# EAGLE design webUSB_V2 combined (EAGLE 9.6.2)
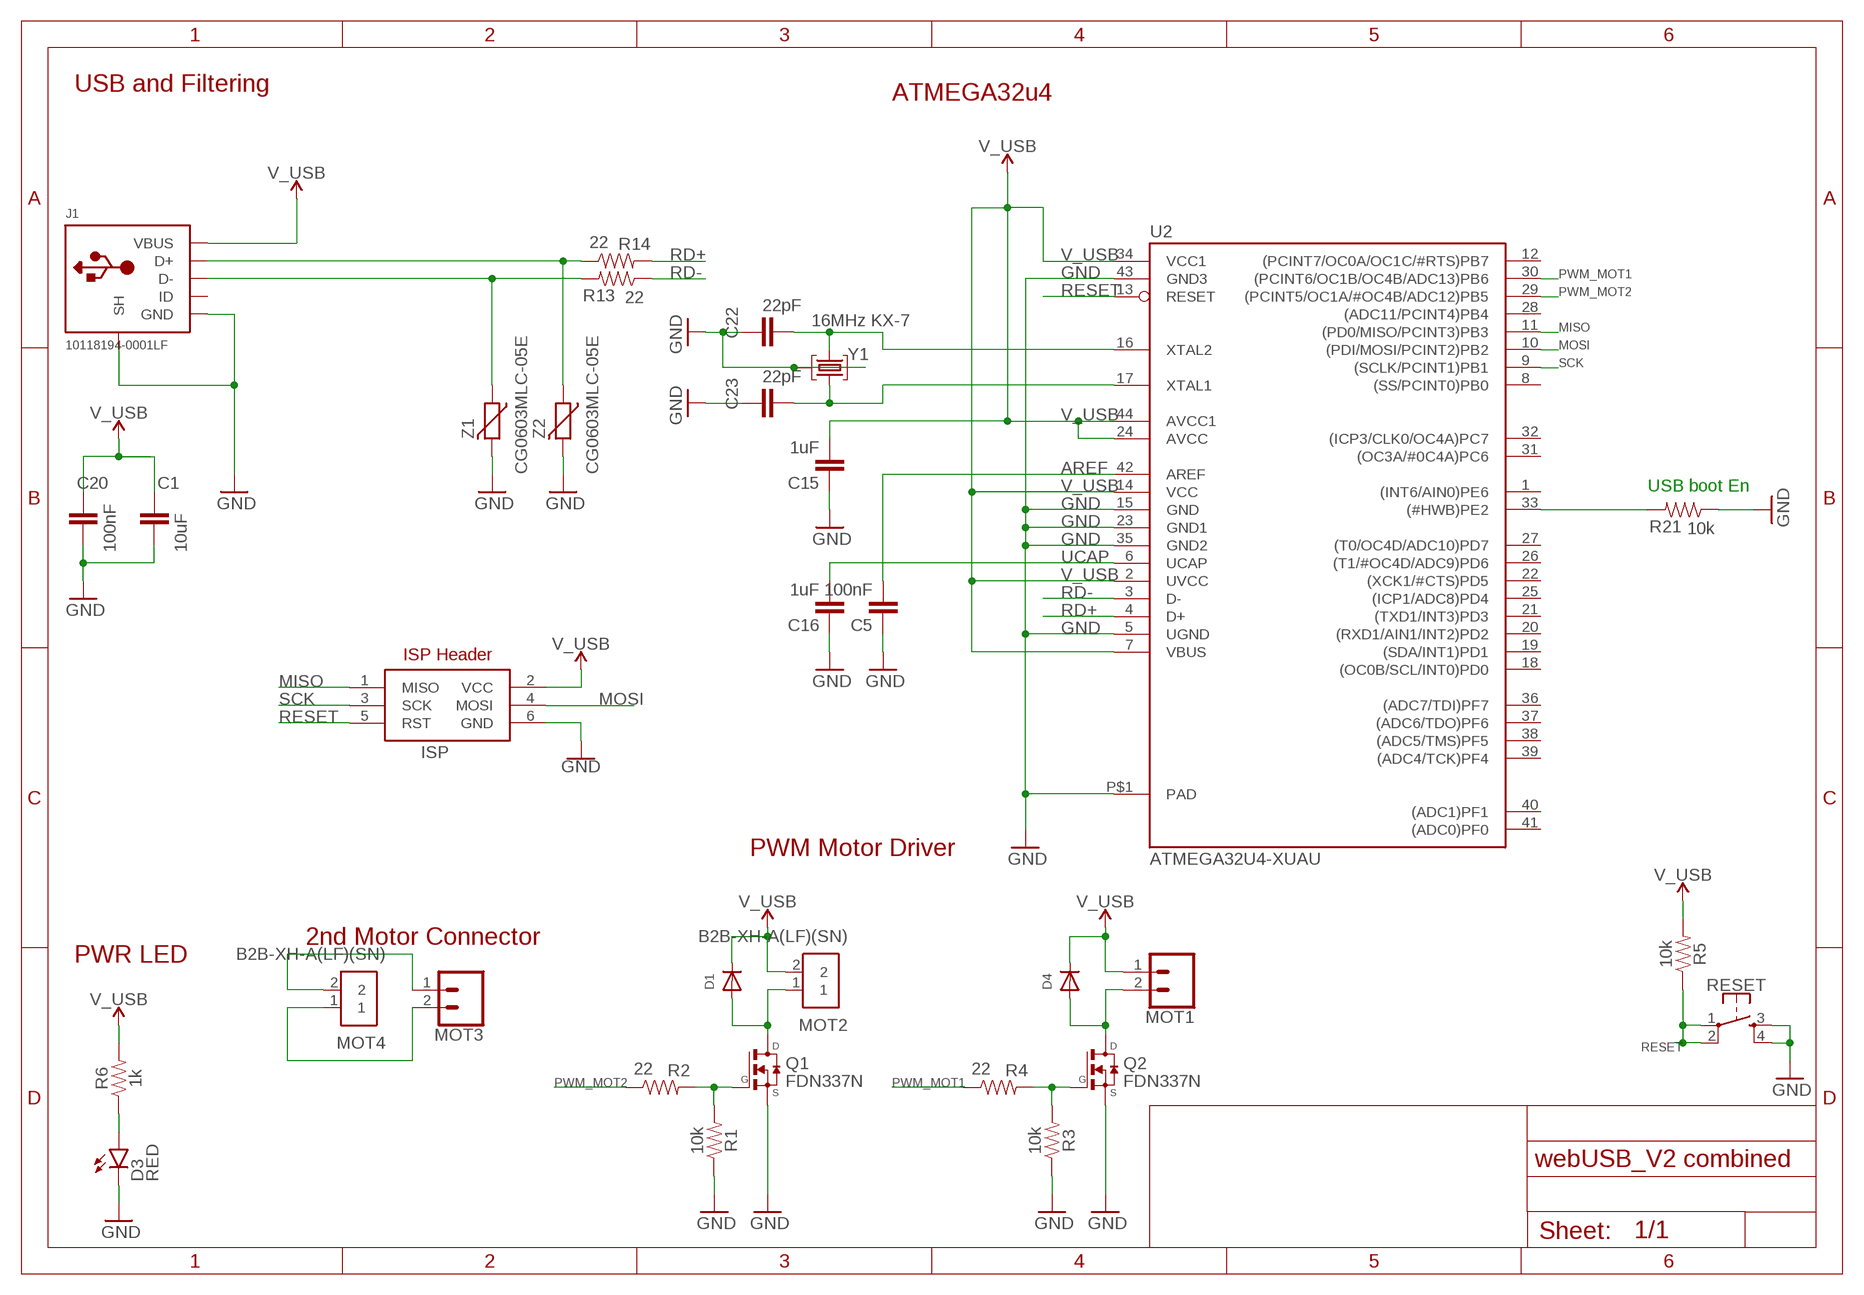
[diagram p0: schematic, sheet 1]

## Parts
C1  10uF  CAPACITORSC0805  [C0805]
C5  100nF  CAPACITORSC0603  [C0603]
C15  1uF  CAPACITORSC0603  [C0603]
C16  1uF  CAPACITORSC0603  [C0603]
C20  100nF  CAPACITORSC0603  [C0603]
C22  22pF  CAPACITORSC0603  [C0603]
C23  22pF  CAPACITORSC0603  [C0603]
D1  DIODESOD-123  [SOD-123]
D3  RED  LED-RED0603  [LED-0603]
D4  DIODESOD-123  [SOD-123]
ISP  AVRISP-6  [AVRISP]
J1  10118194-0001LF  [FRAMATOME_10118194-0001LF]
MOT1  CONN_02  [1X02]
MOT2  B2B-XH-A(LF)(SN)  [SHDR2W64P0X250_1X2_740X575X700]
MOT3  CONN_02  [1X02]
MOT4  B2B-XH-A(LF)(SN)  [SHDR2W64P0X250_1X2_740X575X700]
Q1  FDN337N  [SSOT-3]
Q2  FDN337N  [SSOT-3]
R1  10k  RESISTORSR0603  [R0603]
R2  22  RESISTORSR0603  [R0603]
R3  10k  RESISTORSR0603  [R0603]
R4  22  RESISTORSR0603  [R0603]
R5  10k  RESISTORSR0603  [R0603]
R6  1k  RESISTORSR0603  [R0603]
R13  22  RESISTORSR0603  [R0603]
R14  22  RESISTORSR0603  [R0603]
R21  10k  RESISTORSR0603  [R0603]
RESET  TACTILE_BUTTON_PTS810  [PTS810]
U2  ATMEGA32U4-XUAU  [TQFP44-PAD]
Y1  16MHz KX-7  CRYSTAL-3.2-2.5  [CRYSTAL-3.2-2.5]
Z1  CG0603MLC-05E  VARISTORCN0603  [CT/CN0603]
Z2  CG0603MLC-05E  VARISTORCN0603  [CT/CN0603]

## Nets
AREF: C5.2 U2.42(AREF)
D+: J1.D+ R14.1 Z2.1
D-: J1.D- R13.2 Z1.1
GND: C1.1 C5.1 C15.1 C16.1 C20.1 C22.2 C23.2 D3.C ISP.6(GND) J1.GND J1.SH1(SH) J1.SH2(SH) J1.SH3(SH) J1.SH4(SH) J1.SH5(SH) J1.SH6(SH) J1.SH7(SH) J1.SH8(SH) Q1.2(S) Q2.2(S) R1.1 R3.1 R21.1 RESET.3 RESET.4 U2.5(UGND) U2.15(GND) U2.23(GND1) U2.35(GND2) U2.43(GND3) U2.P$1(PAD) Y1.2(GND) Y1.4(GND) Z1.2 Z2.2
HWB: R21.2 U2.33((#HWB)PE2)
MISO: ISP.1(MISO) U2.11((PD0/MISO/PCINT3)PB3)
MOSI: ISP.4(MOSI) U2.10((PDI/MOSI/PCINT2)PB2)
N$1: Q1.1(G) R1.2 R2.2
N$2: D1.A MOT2.1 Q1.3(D)
N$3: D4.A MOT1.2 Q2.3(D)
N$4: Q2.1(G) R3.2 R4.2
N$5: MOT3.1 MOT4.2
N$6: MOT3.2 MOT4.1
N$9: D3.A R6.1
PWM_MOT1: R4.1 U2.30((PCINT6/OC1B/OC4B/ADC13)PB6)
PWM_MOT2: R2.1 U2.29((PCINT5/OC1A/#OC4B/ADC12)PB5)
RD+: R14.2 U2.4(D+)
RD-: R13.1 U2.3(D-)
RESET: ISP.5(RST) R5.1 RESET.1 RESET.2 U2.13(RESET)
SCK: ISP.3(SCK) U2.9((SCLK/PCINT1)PB1)
UCAP: C16.2 U2.6(UCAP)
V_USB: C1.2 C15.2 C20.2 D1.C D4.C ISP.2(VCC) J1.VUSB(VBUS) MOT1.1 MOT2.2 R5.2 R6.2 U2.2(UVCC) U2.7(VBUS) U2.14(VCC) U2.24(AVCC) U2.34(VCC1) U2.44(AVCC1)
XTAL3: C22.1 U2.16(XTAL2) Y1.3(C2)
XTAL4: C23.1 U2.17(XTAL1) Y1.1(C1)
Unconnected: J1.ID U2.1((INT6/AIN0)PE6) U2.8((SS/PCINT0)PB0) U2.12((PCINT7/OC0A/OC1C/#RTS)PB7) U2.18((OC0B/SCL/INT0)PD0) U2.19((SDA/INT1)PD1) U2.20((RXD1/AIN1/INT2)PD2) U2.21((TXD1/INT3)PD3) U2.22((XCK1/#CTS)PD5) U2.25((ICP1/ADC8)PD4) U2.26((T1/#OC4D/ADC9)PD6) U2.27((T0/OC4D/ADC10)PD7) U2.28((ADC11/PCINT4)PB4) U2.31((OC3A/#0C4A)PC6) U2.32((ICP3/CLK0/OC4A)PC7) U2.36((ADC7/TDI)PF7) U2.37((ADC6/TDO)PF6) U2.38((ADC5/TMS)PF5) U2.39((ADC4/TCK)PF4) U2.40((ADC1)PF1) U2.41((ADC0)PF0)

## Notes on the sheet
- USB and Filtering
- ATMEGA32u4
- USB boot En
- ISP Header
- PWM Motor Driver
- 2nd Motor Connector
- PWR LED

## Library data of the parts
C1 C5 C15 C16 C20 C22 C23 = My-custom-components:CAPACITORS
D1 D4 = adafruit-diode:DIODE: Diode SMADIODE - SMA Surface Mount Package 20V 1A Schottky Diode Digikey: 641-1014-6-ND DO-1N4148 - Through Hole Small Current Diode SOD-123 20V 1 A (.5mV Vf) Schottky Diode - Digikey: MBRX120TPMSCT-ND SOD-323 10V 570mA (.38mV Vf, 3ns) Schottky Diode - Digikey: ZLLS410CT-ND SOD-523 30V 30mA Schottky Diode (RB751S-40TE61) - Digikey: RB751S-40TE61CT-ND SOT23-R/W - SOT23 Package (R = Solder Paste/Reflow Ovens, W = Hand-Soldering) BAT54Film 40V 300mA - Digikey: 497-7162-1-ND
D3 = SparkFun-LED:LED-RED: Red SMD LED Used in manufacturing of most products at SparkFun Packages: 0603 - SMD 0603 package [Product Link] <http://docs.avagotech.com/docs/AV02-0551EN> 0603 SMART - SMD 0603 SMART package ( more efficient and expensive)[Product Link] <http://www.osram-os.com/Graphics/XPic2/00077099_0.pdf> 1206 - SMD1206 package [Product Link] <https://www.sparkfun.com/datasheets/DevTools/LilyPad/Q150OVS4.pdff> SparkFun Products: Pro Mini 328 -5V <https://www.sparkfun.com/products/821> RedBoard <https://www.sparkfun.com/products/12757> IOIO-OTG <https://www.sparkfun.com/products/13613>; PROD_ID: DIO-00819
ISP = adafruit:AVRISP: AVR ISP HEADER Standard 6 pin header for AVR programming
J1 = USB_Micro_b_10118194-0001LF:10118194-0001LF: Conn Micro USB Type B RCP 5 POS 0.65mm Solder RA SMD 5 Terminal 1 Port T/R; AVAILABILITY: Unavailable; DESCRIPTION: Conn Micro USB Type B RCP 5 POS 0.65mm Solder RA SMD 5 Terminal 1 Port T/R; MF: Amphenol; MP: 10118194-0001LF; PACKAGE: DIP-4 FCI; PRICE: None
MOT1 MOT3 = SparkFun-Connectors:CONN_02: Multi connection point. Often used as Generic Header-pin footprint for 0.1 inch spaced/style header connections On any of the 0.1 inch spaced packages, you can populate with these: Break Away Headers - Straight <https://www.sparkfun.com/products/116> (PRT-00116) Break Away Male Headers - Right Angle <https://www.sparkfun.com/products/553> (PRT-00553) Female Headers <https://www.sparkfun.com/products/115> (PRT-00115) Break Away Headers - Machine Pin <https://www.sparkfun.com/products/117> (PRT-00117) Break Away Female Headers - Swiss Machine Pin <https://www.sparkfun.com/products/743> (PRT-00743) For SCREWTERMINALS and SPRING TERMINALS visit here: Screw Terimnals on SparkFun.com <https://www.sparkfun.com/search/results?term=Screw+Terminals> (5mm/3.5mm/2.54mm spacing) This device is also useful as a general connection point to wire up your design to another part of your project. Our various solder wires solder well into these plated through hole pads. Hook-Up Wire - Assortment (Stranded, 22 AWG) <https://www.sparkfun.com/products/11375> (PRT-11375) Hook-Up Wire - Assortment (Solid Core, 22 AWG) <https://www.sparkfun.com/products/11367> (PRT-11367) View the entire wire category on our website here <https://www.sparkfun.com/categories/141> Special notes: Molex polarized connector foot print use with: PRT-08233 with associated crimp pins and housings. 2.54_SCREWTERM for use with PRT-10571. 3.5mm Screw Terminal footprints for PRT-08084 5mm Screw Terminal footprints for use with PRT-08432
MOT2 MOT4 = My-custom-components:B2B-XH-A(LF)(SN): JST XH Series, 2.5mm Pitch 2 Way 1 Row Straight PCB Header, Solder Termination, 3A Source: Datasheet <http://docs-emea.rs-online.com/webdocs/1357/0900766b81357f2f.pdf>; ARROW_PART_NUMBER: B2B-XH-A(LF)(SN); ARROW_PRICE-STOCK: https://www.arrow.com/en/products/b2b-xh-a-lf-sn/jst-manufacturing; DESCRIPTION: JST XH Series, 2.5mm Pitch 2 Way 1 Row Straight PCB Header, Solder Termination, 3A; HEIGHT: 7mm; MANUFACTURER_NAME: JST (JAPAN SOLDERLESS TERMINALS); MANUFACTURER_PART_NUMBER: B2B-XH-A(LF)(SN); RS_PART_NUMBER: 1667312; RS_PRICE-STOCK: http://uk.rs-online.com/web/p/products/1667312
Q1 Q2 = My-custom-components:FDN337N: N-Channel MOSFET Logic Level Enhancement Mode Field Effect Transistor; AVAILABILITY: Unavailable; DESCRIPTION: N-Channel 30 V 65 mOhm Surface Mount Field Effect Transistor - SSOT-3; MF: ON Semiconductor; MP: FDN337N; PACKAGE: SC-59 ON Semiconductor; PRICE: None
R1-R6 R13 R14 R21 = My-custom-components:RESISTORS
RESET = My-custom-components:TACTILE_BUTTON_PTS810: C&K Tactile Switch 611-PTS810SJS250SMTR PTS810 SJM 250 SMTR LFS 160 ± 50 150,000 Force and cycles PTS810 SJK 250 SMTR LFS 260 ± 70 50,000 Force and cycles PTS810 SJG 250 SMTR LFS 400 ± 100 100,000 Force and cycles PTS810 SJS 250 SMTR LFS 600 ± 150 150,000 Force and cycles
U2 = SmartPrj:ATMEGA32U4-XU
Y1 = SmartPrj:CRYSTAL-3.2-2.5
Z1 Z2 = varistor:VARISTOR: VARISTOR

## Net classes
1 12v: width 0.406 mm, drill 0.406 mm, clearance 0.406 mm

## Board
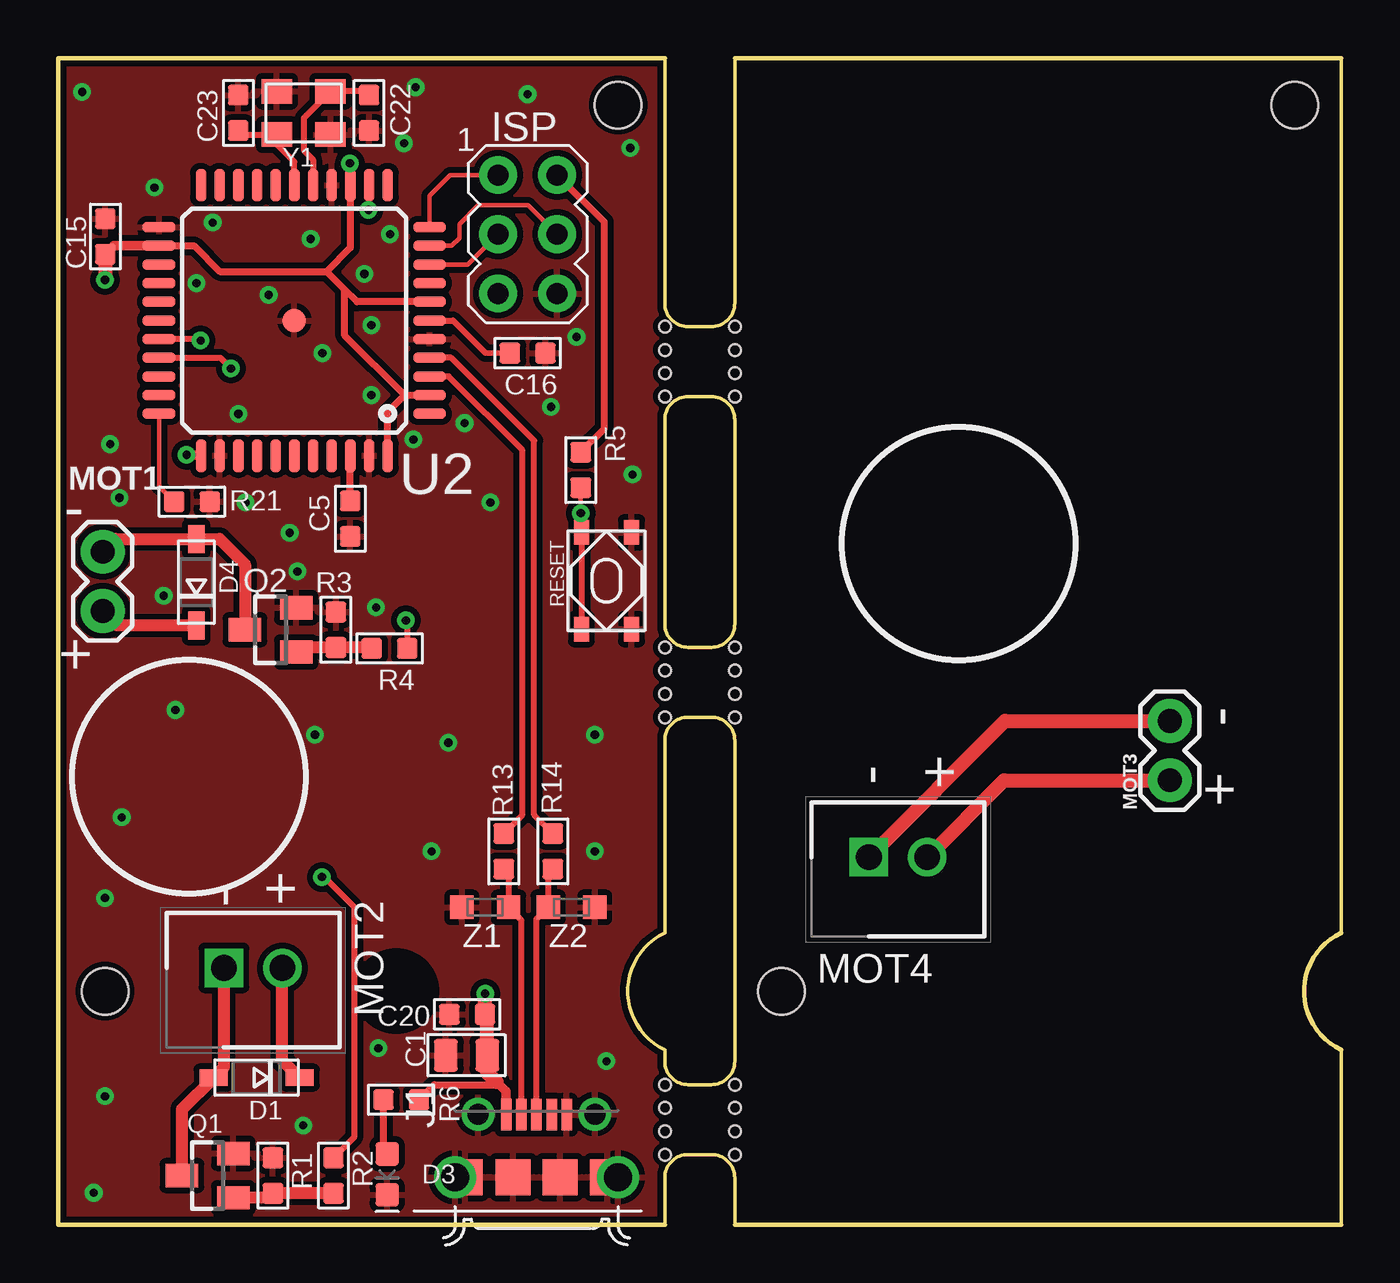
[diagram p1: board, top side]
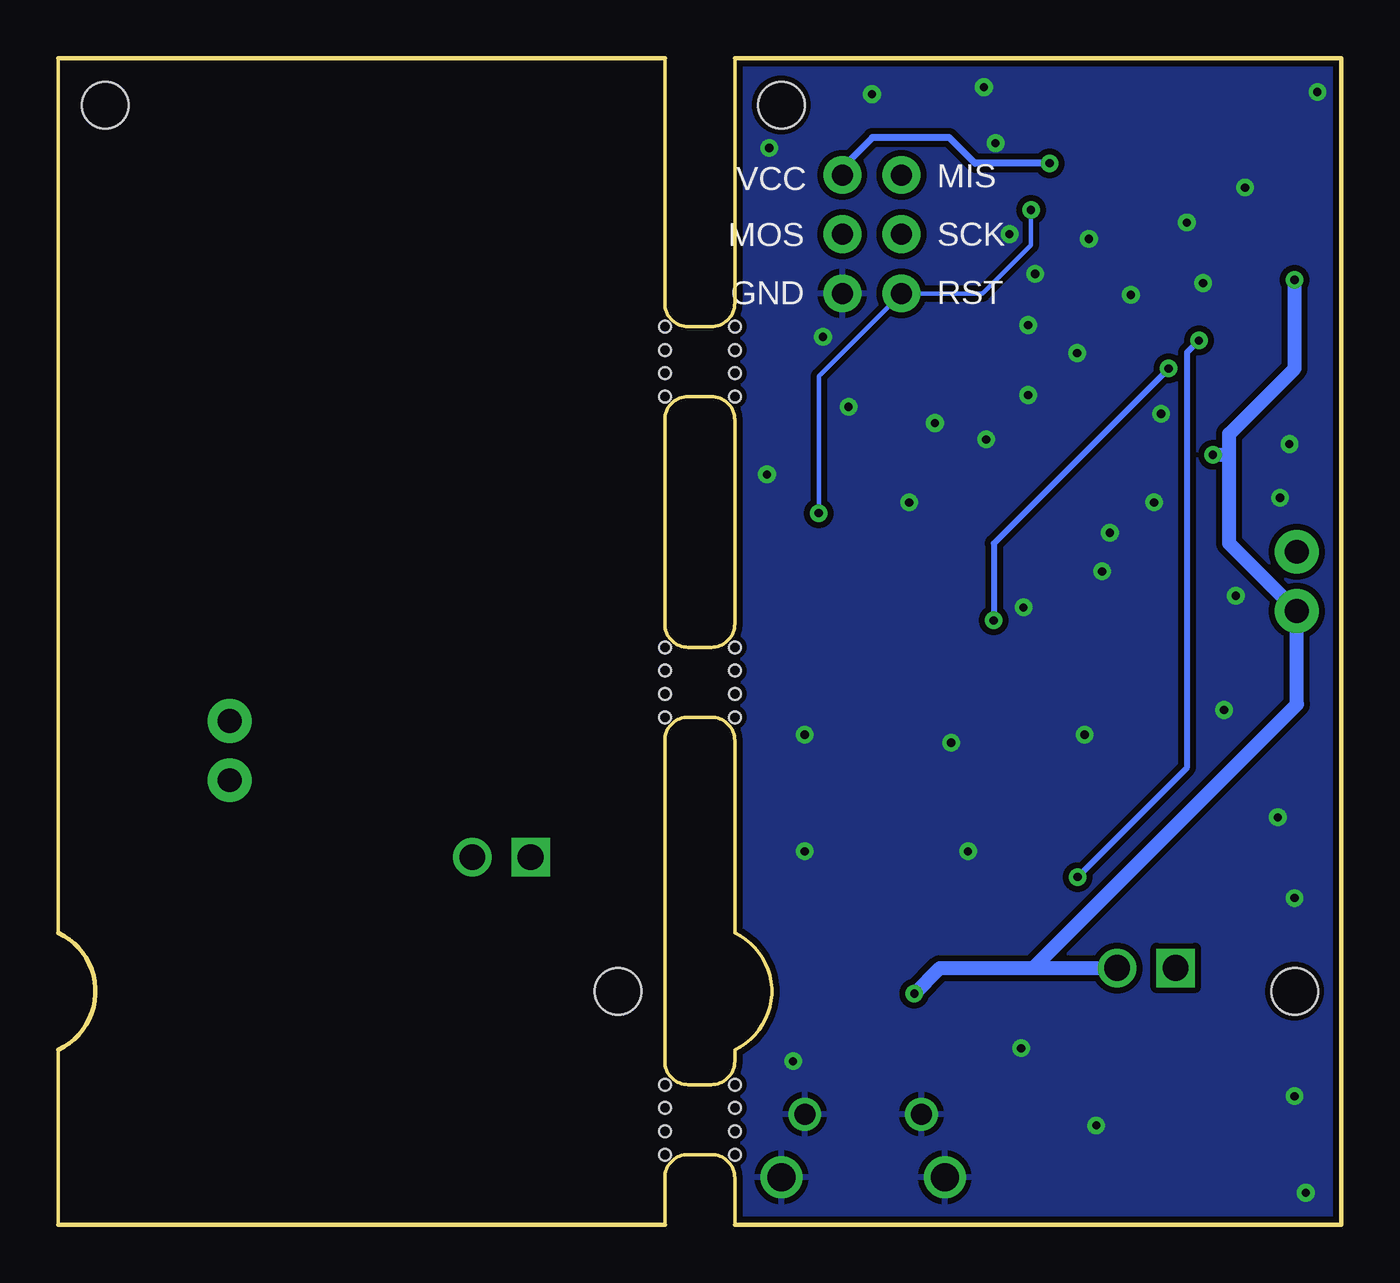
[diagram p2: board, bottom side, seen from below]

Size 55 x 50 mm. Coordinates in mm from the lower left corner, seen from the top.
Outline: 0,0 26,0 26,2 arc-90 27,3 28,3 arc-90 29,2 29,0 55,0 55,7.5 arc-130 55,12.5 55,50 29,50 29,39.5 arc-90 28,38.5 27,38.5 arc-90 26,39.5 26,50 0,50 0,0
Outline: 26,7.5 arc-130 26,12.5 26,20.75 arc-90 27,21.75 28,21.75 arc-90 29,20.75 29,7 arc-90 28,6 27,6 arc-90 26,7 26,7.5
Outline: 26,34.5 26,25.75 arc90 27,24.75 28,24.75 arc90 29,25.75 29,34.5 arc90 28,35.5 27,35.5 arc90 26,34.5
Copper layers (1*16): Top 0.035mm / dielectric 1.5mm / Bottom 0.035mm
Design rules "default *": minimum track width 8mil, minimum drill 0.35mm, track to track 8mil, track to pad 8mil, pad to pad 8mil, via to via 8mil, smd to smd 0mil, copper to edge 10mil, drill to drill 6mil, minimum pad ring 10mil, minimum via ring 8mil, stop-mask expansion 4mil, vias tented up to drill 20mil, thermal gap 10mil
Holes 2 mm at 31,10 53,48 2,10 24,48
Holes 0.5 mm at 26,37.5 26,36.5 26,38.5 29,37.5 29,36.5 29,38.5 29,5 29,4 29,6 26,5 26,4 26,6 26,23.75 26,22.75 26,24.75 29,23.75 29,22.75 29,24.75 26,35.5 29,35.5 29,3 26,3 26,21.75 29,21.75
tRestrict: area 37.4,32.6 to 37.4,35.2; area 13,8.5 to 16,11.5; area 39,8.5 to 42,11.5

### Footprints (pad centres in the part's own frame; a part is rotated, then mirrored left to right if it is on the bottom)
C0805 = smd 1.397 x 1.016: 1 0,0.889; 2 0,-0.889
C0603 = smd 0.889 x 0.889: 1 0,0.762; 2 0,-0.762
SOD-123 = smd 1.2 x 0.7: A 1.85,0; C -1.85,0
LED-0603 = smd 1 x 1: A -0.877,0; C 0.877,0
AVRISP = drill 0.9 pad 1.626: 1 -1.27,2.54; 2 1.27,2.54; 3 -1.27,0; 4 1.27,0; 5 -1.27,-2.54; 6 1.27,-2.54
FRAMATOME_10118194-0001LF = smd 1.35 x 0.45: D+ 2.675,0; D- 2.675,0.65; GND 2.675,-1.3; ID 2.675,-0.65; VUSB 2.675,1.3 | drill 1.2: SH1 0,3.5; SH6 0,-3.5 | smd 1.55 x 1.5: SH2 0,3.05; SH3 0,1; SH4 0,-1; SH5 0,-3.05 | drill 0.9: SH7 2.7,-2.5; SH8 2.7,2.5
1X02 = drill 1.016 pad 1.88: 1 0,0; 2 2.54,0
SHDR2W64P0X250_1X2_740X575X700 = drill 1.1 pad 1.65 square: 1 0,0 | drill 1.1 pad 1.65: 2 2.5,0
SSOT-3 = smd 1 x 1.4: 1 -0.95,-1.1; 2 0.95,-1.1; 3 0,1.1
R0603 = smd 0.889 x 0.889: 1 0,0.762; 2 0,-0.762
PTS810 = smd 1.05 x 0.65: 1 -2.075,1.073; 2 2.075,1.075; 3 -2.075,-1.075; 4 2.075,-1.075
TQFP44-PAD = smd 1.4 x 0.45: 1 -5.8,4; 2 -5.8,3.2; 3 -5.8,2.4; 4 -5.8,1.6; 5 -5.8,0.8; 6 -5.8,0; 7 -5.8,-0.8; 8 -5.8,-1.6; 9 -5.8,-2.4; 10 -5.8,-3.2; 11 -5.8,-4; 23 5.8,-4; 24 5.8,-3.2; 25 5.8,-2.4; 26 5.8,-1.6; 27 5.8,-0.8; 28 5.8,0; 29 5.8,0.8; 30 5.8,1.6; 31 5.8,2.4; 32 5.8,3.2; 33 5.8,4 | smd 0.45 x 1.4: 12 -4,-5.8; 13 -3.2,-5.8; 14 -2.4,-5.8; 15 -1.6,-5.8; 16 -0.8,-5.8; 17 0,-5.8; 18 0.8,-5.8; 19 1.6,-5.8; 20 2.4,-5.8; 21 3.2,-5.8; 22 4,-5.8; 34 4,5.8; 35 3.2,5.8; 36 2.4,5.8; 37 1.6,5.8; 38 0.8,5.8; 39 0,5.8; 40 -0.8,5.8; 41 -1.6,5.8; 42 -2.4,5.8; 43 -3.2,5.8; 44 -4,5.8 | smd 1 x 1: P$1 0,0
CRYSTAL-3.2-2.5 = smd 1.3 x 1.05: 1 -1.15,-0.925; 2 1.15,-0.925; 3 1.15,0.925; 4 -1.15,0.925
CT/CN0603 = smd 1 x 1: 1 -1,0; 2 1,0

### Placement (x,y rotation side)
C1  17.5,7.26 90 top
C5  12.52,30.26 180 top
C15  2.02,42.36 0 top
C16  20.12,37.36 270 top
C20  17.53,9.01 90 top
C22  13.32,47.66 0 top
C23  7.72,47.66 180 top
D1  8.5,6.3 180 top
D3  14.1,2.15 270 top
D4  5.92,27.54 90 top
ISP  20.12,42.46 0 top
J1  20.5,2.03 90 top
MOT1  1.9,26.3 90 top
MOT2  7.1,11 0 top
MOT3  47.65,19.05 90 top
MOT4  34.75,15.75 0 top
Q1  6.4,2.1 90 top
Q2  9.1,25.5 90 top
R1  9.2,2.1 0 top
R2  11.8,2.1 0 top
R3  11.9,25.5 0 top
R4  14.2,24.7 270 top
R5  22.4,32.35 180 top
R6  14.7,5.35 90 top
R13  19.1,16 0 top
R14  21.2,16 180 top
R21  5.73,30.99 270 top
RESET  23.5,27.6 90 top
U2  10.12,38.76 180 top
Y1  10.52,47.66 0 top
Z1  18.3,13.6 180 top
Z2  22,13.6 0 top

### Tracks (layer width: path | path; a pad name or v marks a point on that pad's centre or on a via)
AREF
  Top 0.305: C5.2 U2.42
D+
  Top 0.254: J1.D+ 20.5,13.1 Z2.1 21,15.04 R14.1
D-
  Top 0.254: J1.D- 19.85,13.05 Z1.1 19.3,15.04 R13.2
GND  (via drill 0.35)
  other vias: 11,21 23,21 16,16 23,16 2,14 10.25,28 10.5,4.25 2,5.5 23.5,7 9.02,39.86 14.82,46.36 11.32,37.36 15.32,48.76 10.82,42.26 14.22,42.46 6.62,42.96 5.92,40.36 13.42,35.56 17.42,34.36 15.22,33.66 7.72,34.76 2.22,33.46 9.92,29.66 4.52,26.96 24.62,32.16 21.12,35.06 22.22,38.06 13.72,7.56 1.52,1.36 2.72,17.46 5.02,22.06 16.72,20.66 18.52,30.96 13.62,26.46 8.02,30.96 2.62,31.16 13.42,38.56 13.12,40.76 4.12,44.46 1.02,48.56 24.52,46.16 20.12,48.46
  pour Top (isolate 0.254): -1,51 57.75,51 57.75,-1 -1,-1
  pour Bottom (isolate 0.254): -1,51 56.75,51 56.75,-1 -1,-1
HWB
  Top 0.203: R21.2 4.32,31.64 U2.33
MISO
  Top 0.203: ISP.1 16.8,45 15.92,44.12 U2.11
MOSI
  Top 0.203: U2.10 16.86,41.96 17.2,42.3 17.2,42.9 18,43.7 20.15,43.7 ISP.4
N$1
  Top 0.254: 9.3,1.34 R1.2
  Top 0.508: R2.2 9.3,1.34 | R1.2 9.01,1.15 Q1.1
N$2
  Top 0.508: Q1.3 5.3,4.95 D1.A 7.1,6.75 MOT2.1
N$3
  Top 0.508: MOT1.2 2.45,29.39 D4.A 6.91,29.39 8,28.3 Q2.3
N$4
  Top 0.508: R4.2 13.4,24.74 R3.2 10.39,24.74 Q2.1
N$5
  Top 0.61: MOT4.2 40.55,19.05 MOT3.1
N$6
  Top 0.61: MOT4.1 40.59,21.59 MOT3.2
N$9
  Top 0.305: D3.A 13.94,3.19 R6.1
  Top 0.406: 14.1,3.11 D3.A
PWM_MOT1  (via drill 0.35)
  Top 0.254: U2.30 6.94,37.16 v7.4,36.7 | v14.9,25.9 14.96,25.84 R4.1
  Bottom 0.254: v7.4,36.7 14.9,29.2 v14.9,25.9
PWM_MOT2  (via drill 0.35)
  Top 0.254: R2.1 12.7,3.76 12.7,13.6 11.4,14.9 v11.3,14.9 | v6.1,37.9 6.04,37.96 U2.29
  Bottom 0.254: v11.3,14.9 6.6,19.6 6.6,37.4 v6.1,37.9
RD+
  Top 0.254: R14.2 20.4,17.56 20.4,33.6 16.84,37.16 U2.4
RD-
  Top 0.254: R13.1 19.9,17.56 19.9,33.2 16.74,36.36 U2.3
RESET  (via drill 0.35)
  Top 0.203: U2.13 13.32,43.52 v13.3,43.5 | 22.43,29.5 22.4,29.52 v22.4,30.5 R5.1
  Top 0.254: RESET.2 22.43,29.5 RESET.1
  Bottom 0.203: v13.3,43.5 13.3,42 15.38,39.92 ISP.5 22.4,36.37 v22.4,30.5
SCK
  Top 0.203: U2.9 17.55,41.16 ISP.3
UCAP
  Top 0.254: U2.6 16.92,38.76 18.3,37.38 C16.2
V_USB  (via drill 0.35)
  Top 0.203: v12.5,45.5 12.52,45.48 U2.14
  Top 0.305: U2.24 5.82,41.96 6.92,40.86 11.5,40.86 | 14.84,35.56 U2.2 | U2.44 14.12,34.84 14.84,35.56 | ISP.2 23.4,42.99 23.4,34.11 R5.2 | U2.7 12.8,39.56 12.28,40.08 | 12.28,40.08 11.5,40.86 | 12.28,40.08 12.28,38.12 14.84,35.56 | U2.14 12.52,41.88 11.5,40.86 | R6.2 16.11,6 18.7,6 18.8,6.1
  Top 0.406: J1.VUSB 19.2,5.7 18.8,6.1 | v5.5,33 6.08,33 U2.34 | U2.24 2.38,41.96 C15.2
  Top 0.508: D1.C 9.6,7.05 MOT2.2 | D4.C 2.51,25.69 MOT1.1
  Top 0.61: 18.8,6.1 18.39,6.51 C1.2 18.39,8.91 C20.2 18.29,9.89 v18.3,9.9 | C15.2 2.02,40.52 v2,40.5
  Bottom 0.305: v12.5,45.5 15.7,45.5 16.8,46.6 20.1,46.6 21.39,45.31 ISP.2
  Bottom 0.508: 9.6,14.6 4.7,19.5 4.45,19.75 1.9,22.3
  Bottom 0.61: v18.3,9.9 17.2,11 13.2,11 | 13.2,11 9.6,14.6 4.45,19.75 | 13.2,11 MOT2.2 | 4.7,19.5 1.9,22.3 MOT1.1 4.8,29.2 4.8,33.2 | 4.8,33.2 4.8,33.9 2,36.7 v2,40.5 | 4.8,33.2 5,33 v5.5,33
XTAL3
  Top 0.254: U2.16 10.92,45.66 10.52,46.06 10.52,47.44 Y1.3 13.16,48.59 C22.1
XTAL4
  Top 0.254: U2.17 10.12,45.56 9.37,46.31 Y1.1 7.88,46.73 C23.1

### Text on the board
tPlace: - | + | - | - | + | + | + | -
bPlace: VCC | MIS | MOS | SCK | GND | RST